# EAGLE board E-Book_Reader_Schematic (EAGLE 9.7.0)
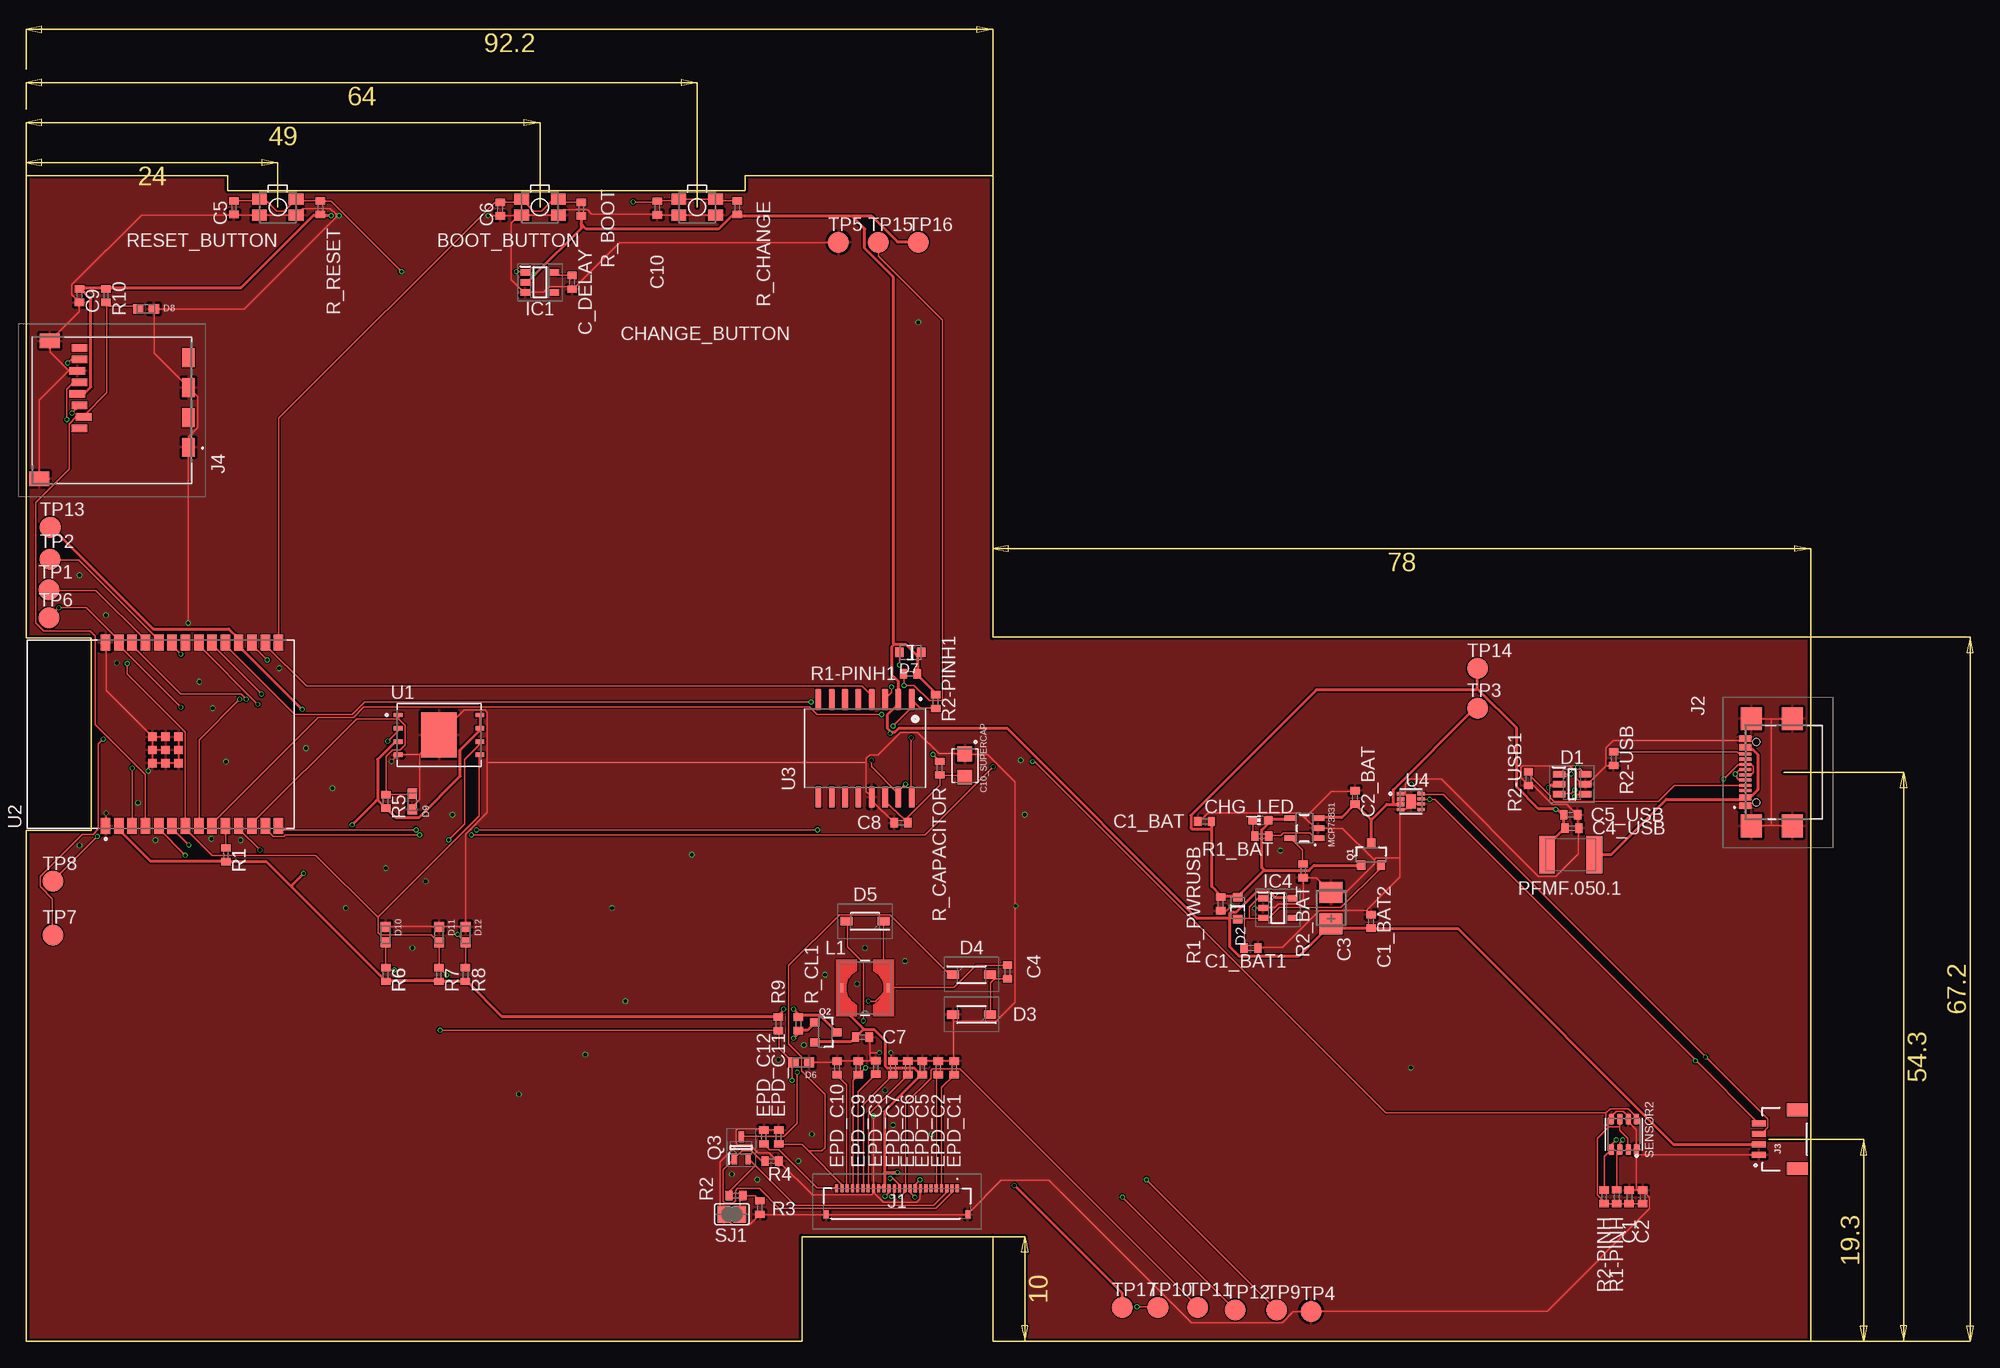
[diagram p1: board, top side]
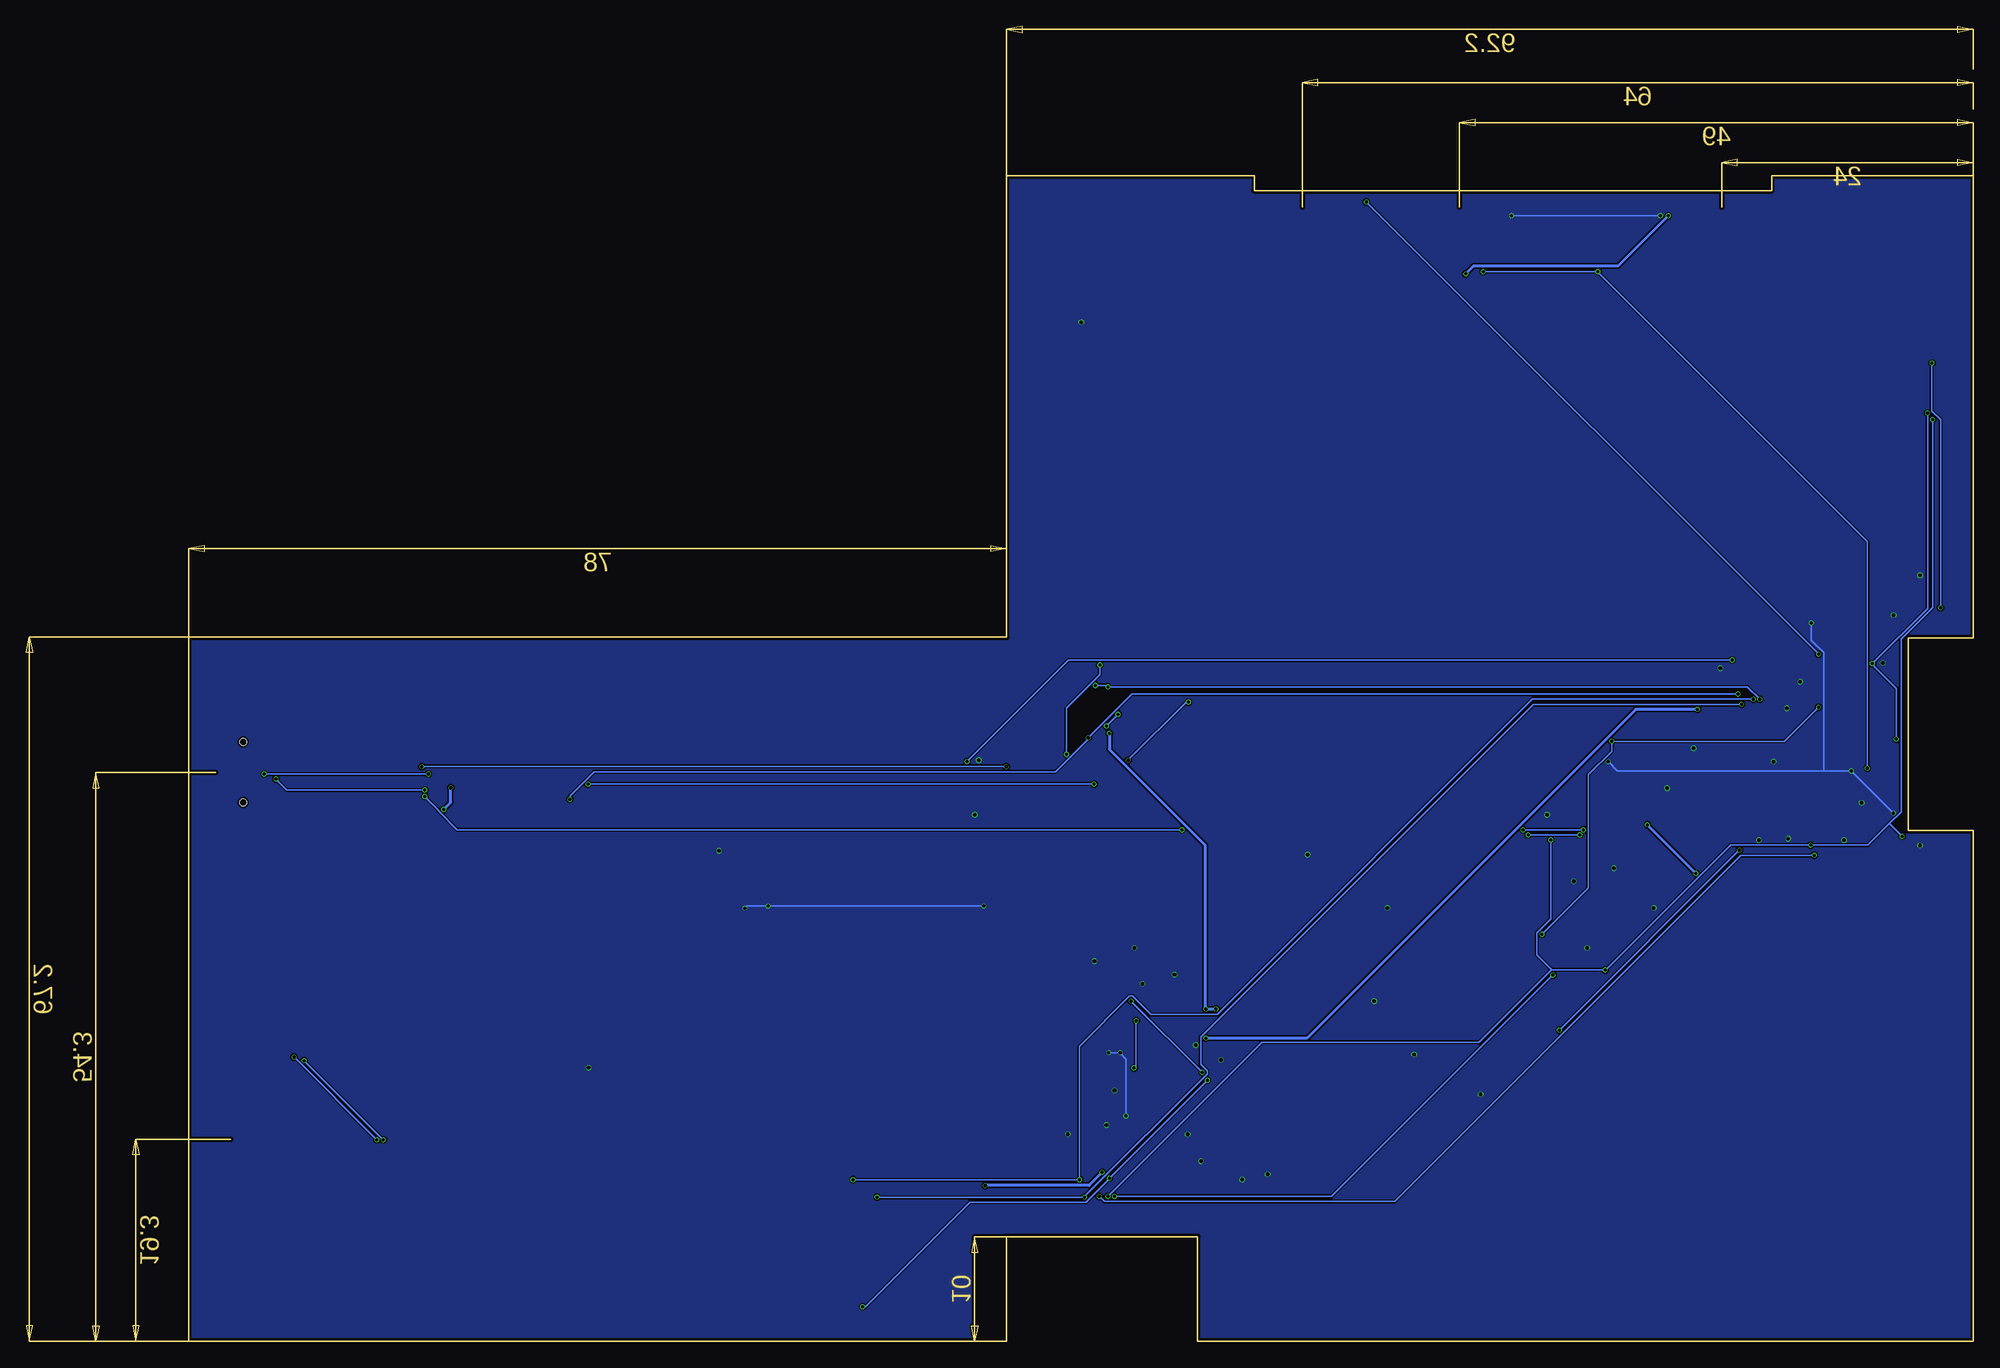
[diagram p2: board, bottom side, seen from below]

Size 170.2 x 111.2 mm. Coordinates in mm from the lower left corner, seen from the top.
Outline: 0,48.75 0,0 74,0 74,10 92.2,10 92.2,0 165.3,0 166.21,0 167.64,0 170.2,0 170.2,67.2 92.2,67.2 92.2,111.2 68.58,111.2 68.58,109.79 19.24,109.79 19.24,111.2 0,111.2 0,108.2 0,95.9 0,67.1 6.22,67.1 6.22,48.75 0,48.75
Copper layers (1*16): Top 0.035mm / dielectric 1.6mm / Bottom 0.035mm
Design rules "jlcpcb-2layers.dru": minimum track width 0.15mm, minimum drill 0.3mm, track to track 5mil, track to pad 5mil, pad to pad 5mil, via to via 5mil, smd to smd 5mil, copper to edge 0.2mm, drill to drill 6mil, minimum pad ring 10mil, minimum via ring 3mil, stop-mask expansion 4mil, vias tented up to drill 0mil, thermal gap 10mil
Net classes: 1 ALIMENTATION: width 0.3 mm

## Footprints (pad centres in the part's own frame; a part is rotated, then mirrored left to right if it is on the bottom)
MYBUTTON = smd 1.4 x 1.05: 1 1.75,0.75; 2 -1.75,0.75; 3 -1.75,-0.75; 4 1.75,-0.75
EAGLE-LTSPICE_C0402 = smd 0.7 x 0.9: 1 -0.65,0; 2 0.65,0
RCL_CT3528 = smd 2 x 2.2: + -1.5,0; - 1.5,0
ESP32_WROVER_EAGLE-LTSPICE_C0402 = smd 0.7 x 0.9: 1 -0.65,0; 2 0.65,0
CAPCP3225X100N = smd 1.4 x 1.4: 1 -1.1,0; 2 1.1,0
ADAFRUIT_CHIP-LED0603 = smd 0.8 x 0.8: A 0,-0.75; C 0,0.75
SOT95P280X145-6N = smd 1.2 x 0.6: 1 -1.25,0.95; 2 -1.25,0; 3 -1.25,-0.95; 4 1.25,-0.95; 5 1.25,0; 6 1.25,0.95
ESP32_WROVER_AVX---SD0805S020S1R0_AVX_SD0805S020S1R0_0 = smd 0.8 x 0.9: 1 -1.05,0; 2 1.05,0
SOD3716X135N = smd 1.15 x 0.8: 1 -1.75,0; 2 1.75,0
DIOC1608X36N = smd 0.97 x 0.94: 1 -0.75,0; 2 0.75,0
SOT95P280X125-5N = smd 0.9 x 0.6: 1 -1.4,0.95; 2 -1.4,0; 3 -1.4,-0.95; 4 1.4,-0.95; 5 1.4,0.95
SOT95P280X120-5N = smd 0.9 x 0.6: 1 -1.4,0.95; 2 -1.4,0; 3 -1.4,-0.95; 4 1.4,-0.95; 5 1.4,0.95
FH34SRJ24S05SH99 = smd 0.3 x 0.8: 1 5.75,1.45; 2 5.25,1.45; 3 4.75,1.45; 4 4.25,1.45; 5 3.75,1.45; 6 3.25,1.45; 7 2.75,1.45; 8 2.25,1.45; 9 1.75,1.45; 10 1.25,1.45; 11 0.75,1.45; 12 0.25,1.45; 13 -0.25,1.45; 14 -0.75,1.45; 15 -1.25,1.45; 16 -1.75,1.45; 17 -2.25,1.45; 18 -2.75,1.45; 19 -3.25,1.45; 20 -3.75,1.45; 21 -4.25,1.45; 22 -4.75,1.45; 23 -5.25,1.45; 24 -5.75,1.45 | smd 0.4 x 0.8: MP1 6.75,-1.05; MP2 -6.75,-1.05
SAMACSYS_PARTS_USB4110GFA = smd 0.3 x 1.15: A1 -3.35,3.678; A4 -2.55,3.678; A5 -1.25,3.678; A6 -0.25,3.678; A7 0.25,3.678; A8 1.25,3.678; A9 2.55,3.678; A12 3.35,3.678; B1 3.05,3.678; B4 2.25,3.678; B5 1.75,3.678; B6 0.75,3.678; B7 -0.75,3.678; B8 -1.75,3.678; B9 -2.25,3.678; B12 -3.05,3.678 | smd 2.18 x 2: MP1 -5.11,-0.827; MP2 5.11,-0.827; MP3 -5.11,3.103; MP4 5.11,3.103 | hole 0.65: -2.89,2.603; 2.89,2.603
JST04_1MM_RA = smd 0.6 x 1.35: 1 -1.5,0; 2 -0.5,0; 3 0.5,0; 4 1.5,0 | smd 1.2 x 2: NC1 2.8,-3.675; NC2 -2.8,-3.675
112ATAARR03ATTEND = smd 1.8 x 1.2: G1 10.6,10.4; G2 4.9,10.4; S1 7.75,10.4; S2 2.05,10.4 | smd 1.4 x 1.9: G3 13.6,-3.85; G4 0.45,-2.85 | smd 0.7 x 1.5: P1 8.8,0; P2 7.7,0.4; P3 6.6,0; P4 5.5,-0.2; P5 4.4,0; P6 3.3,-0.2; P7 2.2,0; P8 1.1,0
IND_4828-WE-TPC_WRE = smd 0.406 x 0.813: 1 -2.286,0; 2 2.286,0
ESP32_WROVER_SPARKFUN-IC-POWER_SOT23-5 = smd 0.55 x 1.2: 1 -0.95,-1.3; 2 0,-1.3; 3 0.95,-1.3; 4 0.95,1.3; 5 -0.95,1.3
ESP32C6_VARISTOR_CT/CN1812 = smd 1.5 x 3.6: 1 -2.25,0; 2 2.25,0
ESP32_WROVER_SPARKFUN-DISCRETESEMI_SOT23-3 = smd 0.8 x 0.9: 1 -0.95,-1; 2 0.95,-1; 3 0,1.1
SOT65P210X110-3N = smd 1.05 x 0.5: 1 -1.05,0.65; 2 -1.05,-0.65; 3 1.05,0
ESP32_WROVER_EAGLE-LTSPICE_R0402 = smd 0.7 x 0.9: 1 -0.65,0; 2 0.65,0
ESP32_WROVER_BME680_PSON80P300X300X100-8N = smd 1.016 x 0.5: 1 1.458,1.2; 2 1.458,0.4; 3 1.458,-0.4; 4 1.458,-1.2; 5 -1.458,-1.22; 6 -1.458,-0.4; 7 -1.458,0.4; 8 -1.458,1.2
SJ = smd 1.168 x 1.6: 1 -0.762,0; 2 0.762,0
TP20R = smd 2 x 2: TP 0,0
SON127P600X800X80-9N = smd 0.94 x 0.44: 1 -3.895,1.905; 2 -3.895,0.635; 3 -3.895,-0.635; 4 -3.895,-1.905; 5 3.895,-1.905; 6 3.895,-0.635; 7 3.895,0.635; 8 3.895,1.905 | smd 3.4 x 4.3: 9 0,0
XCVR_ESP32-C6-WROOM-1-N8 = smd 1.5 x 0.9: 1 -8.75,5.26; 2 -8.75,3.99; 3 -8.75,2.72; 4 -8.75,1.45; 5 -8.75,0.18; 6 -8.75,-1.09; 7 -8.75,-2.36; 8 -8.75,-3.63; 9 -8.75,-4.9; 10 -8.75,-6.17; 11 -8.75,-7.44; 12 -8.75,-8.71; 13 -8.75,-9.98; 14 -8.75,-11.25; 15 8.75,-11.25; 16 8.75,-9.98; 17 8.75,-8.71; 18 8.75,-7.44; 19 8.75,-6.17; 20 8.75,-4.9; 21 8.75,-3.63; 22 8.75,-2.36; 23 8.75,-1.09; 24 8.75,0.18; 25 8.75,1.45; 26 8.75,2.72; 27 8.75,3.99; 28 8.75,5.26 | smd 0.8 x 0.8: 29_1 -2.755,0.79; 29_2 -1.505,0.79; 29_3 -0.255,0.79; 29_4 -2.755,-0.46; 29_5 -1.505,-0.46; 29_6 -0.255,-0.46; 29_7 -2.755,-1.71; 29_8 -1.505,-1.71; 29_9 -0.255,-1.71
SOIC127P1032X265-16N = smd 2.05 x 0.59: 1 -4.655,4.445; 2 -4.655,3.175; 3 -4.655,1.905; 4 -4.655,0.635; 5 -4.655,-0.635; 6 -4.655,-1.905; 7 -4.655,-3.175; 8 -4.655,-4.445; 9 4.655,-4.445; 10 4.655,-3.175; 11 4.655,-1.905; 12 4.655,-0.635; 13 4.655,0.635; 14 4.655,1.905; 15 4.655,3.175; 16 4.655,4.445
SON50P200X200X80-9N = smd 0.76 x 0.27: 1 -0.985,0.75; 4 -0.985,-0.75; 5 0.985,-0.75; 6 0.985,-0.25; 7 0.985,0.25; 8 0.985,0.75 | smd 0.813 x 0.406: 2 -0.985,0.25; 3 -0.985,-0.25 | smd 0.9 x 1.3: 9 0,0

## Placement (x,y rotation side)
BOOT_BUTTON  BUTTON_CUSYOMV1  [MYBUTTON]  49,108.2 180 top
C1  100nF  [EAGLE-LTSPICE_C0402]  152.91,13.79 90 top
C1_BAT  4.7uF  [EAGLE-LTSPICE_C0402]  112.39,49.61 180 top
C1_BAT1  4.7uF  [EAGLE-LTSPICE_C0402]  116.84,37.54 0 top
C1_BAT2  4.7uF  [EAGLE-LTSPICE_C0402]  128.27,40.08 90 top
C2  100nF  [EAGLE-LTSPICE_C0402]  154.18,13.79 90 top
C2_BAT  4.7uF  [EAGLE-LTSPICE_C0402]  126.75,51.89 90 top
C3  100uF TANT  [RCL_CT3528]  124.46,41.35 90 top
C4  4.7uF/25V  [EAGLE-LTSPICE_C0402]  93.6,35.25 90 top
C4_USB  100nF  [ESP32_WROVER_EAGLE-LTSPICE_C0402]  147.45,48.97 0 top
C5  1uF  [EAGLE-LTSPICE_C0402]  19.81,108.15 270 top
C5_USB  4.7uF  [ESP32_WROVER_EAGLE-LTSPICE_C0402]  147.32,50.24 0 top
C6  100nF  [EAGLE-LTSPICE_C0402]  45.21,108.03 270 top
C7  10uF  [EAGLE-LTSPICE_C0402]  79.76,29.03 0 top
C8  100nF  [EAGLE-LTSPICE_C0402]  83.44,49.48 180 top
C9  100nF  [ESP32_WROVER_EAGLE-LTSPICE_C0402]  5.08,99.77 270 top
C10  100nF  [EAGLE-LTSPICE_C0402]  60.2,108.13 270 top
C10_SUPERCAP  CPH3225A  [CAPCP3225X100N]  89.53,54.94 270 top
C_DELAY  100nF  [EAGLE-LTSPICE_C0402]  52.07,101.04 270 top
CHANGE_BUTTON  BUTTON_CUSYOMV1  [MYBUTTON]  64,108.2 180 top
CHG_LED  [ADAFRUIT_CHIP-LED0603]  117.73,49.73 90 top
D1  USBLC6-2SC6Y  [SOT95P280X145-6N]  147.45,53.16 0 top
D2  SD0805S020S1R0  [ESP32_WROVER_AVX---SD0805S020S1R0_AVX_SD0805S020S1R0_0]  115.57,41.35 270 top
D3  MBR05301  [SOD3716X135N]  90.17,31.19 180 top
D4  MBR05301  [SOD3716X135N]  90.17,35 0 top
D5  MBR05301  [SOD3716X135N]  80.01,40.08 180 top
D6  PGB1010603MR  [DIOC1608X36N]  73.91,26.62 180 top
D7  SD0805S020S1R0  [ESP32_WROVER_AVX---SD0805S020S1R0_AVX_SD0805S020S1R0_0]  84.33,65.73 180 top
D8  PGB1010603MR  [DIOC1608X36N]  11.43,98.5 180 top
D9  PGB1010603MR  [DIOC1608X36N]  36.83,51.51 90 top
D10  PGB1010603MR  [DIOC1608X36N]  34.29,38.81 270 top
D11  PGB1010603MR  [DIOC1608X36N]  39.37,38.81 270 top
D12  PGB1010603MR  [DIOC1608X36N]  41.91,38.81 270 top
EPD_C1  1uF/50V  [EAGLE-LTSPICE_C0402]  88.52,26.11 90 top
EPD_C2  1uF/50V  [EAGLE-LTSPICE_C0402]  87,26.11 90 top
EPD_C5  0.1uF/50V  [EAGLE-LTSPICE_C0402]  85.47,26.11 90 top
EPD_C6  1uF/50V  [EAGLE-LTSPICE_C0402]  84.07,26.11 90 top
EPD_C7  1uF/50V  [EAGLE-LTSPICE_C0402]  82.68,26.11 90 top
EPD_C8  1uF/50V  [EAGLE-LTSPICE_C0402]  81.03,26.14 90 top
EPD_C9  1uF/50V  [EAGLE-LTSPICE_C0402]  79.38,26.11 90 top
EPD_C10  1uF/50V  [EAGLE-LTSPICE_C0402]  77.34,26.11 90 top
EPD_C11  1uF/50V  [EAGLE-LTSPICE_C0402]  71.77,19.51 90 top
EPD_C12  1uF/50V  [EAGLE-LTSPICE_C0402]  70.36,19.51 90 top
IC1  BD5229G-TR  [SOT95P280X125-5N]  49,101.04 0 top
IC4  XC6220A331MR-G  [SOT95P280X120-5N]  119.38,41.35 0 top
J1  FH34SRJ-24S-0.5SH_99_  [FH34SRJ24S05SH99]  83.06,13.16 0 top
J2  SAMACSYS_PARTS_USB4110-GF-A  [SAMACSYS_PARTS_USB4110GFA]  167.64,54.3 90 top
J3  QWIIC_RIGHT_ANGLE  [JST04_1MM_RA]  165.25,19.3 90 top
J4  112A-TAAR-R03_ATTEND  [112ATAARR03ATTEND]  5.08,95.9 270 top
L1  68uH  [IND_4828-WE-TPC_WRE]  80.01,33.73 180 top
MCP73831  ESP32_WROVER_SPARKFUN-IC-POWER_MCP73831  [ESP32_WROVER_SPARKFUN-IC-POWER_SOT23-5]  121.92,48.97 90 top
PFMF.050.1  ESP32C6_VARISTORCN1812  [ESP32C6_VARISTOR_CT/CN1812]  147.32,46.43 0 top
Q1  20V/4.2A/52mΩ/1.4W  [ESP32_WROVER_SPARKFUN-DISCRETESEMI_SOT23-3]  128.27,46.43 0 top
Q2  20V/4.2A/52mΩ/1.4W  [ESP32_WROVER_SPARKFUN-DISCRETESEMI_SOT23-3]  76.22,29.49 270 top
Q3  SI1308EDL-T1-GE3  [SOT65P210X110-3N]  68.2,18.49 90 top
R1  10K  [ESP32_WROVER_EAGLE-LTSPICE_R0402]  19.05,46.43 270 top
R1-PINH  10K  [ESP32_WROVER_EAGLE-LTSPICE_R0402]  151.71,13.81 270 top
R1-PINH1  10K  [ESP32_WROVER_EAGLE-LTSPICE_R0402]  84.33,63.7 0 top
R1_BAT  200  [ESP32_WROVER_EAGLE-LTSPICE_R0402]  117.86,48.21 0 top
R1_PWRUSB  100K  [ESP32_WROVER_EAGLE-LTSPICE_R0402]  113.92,41.73 90 top
R2  2.2  [ESP32_WROVER_EAGLE-LTSPICE_R0402]  69.98,12.78 90 top
R2-PINH  10K  [ESP32_WROVER_EAGLE-LTSPICE_R0402]  150.52,13.79 270 top
R2-PINH1  10K  [ESP32_WROVER_EAGLE-LTSPICE_R0402]  86.74,61.04 90 top
R2-USB  5K1  [ESP32_WROVER_EAGLE-LTSPICE_R0402]  151.41,55.6 270 top
R2-USB1  5k1  [ESP32_WROVER_EAGLE-LTSPICE_R0402]  143.28,53.69 90 top
R2_BAT  2K  [ESP32_WROVER_EAGLE-LTSPICE_R0402]  121.79,44.91 90 top
R3  0.47  [ESP32_WROVER_EAGLE-LTSPICE_R0402]  67.69,13.92 180 top
R4  10K  [ESP32_WROVER_EAGLE-LTSPICE_R0402]  71.12,17.22 180 top
R5  10K  [ESP32_WROVER_EAGLE-LTSPICE_R0402]  34.29,51.51 270 top
R6  10K  [ESP32_WROVER_EAGLE-LTSPICE_R0402]  34.29,35 270 top
R7  10K  [ESP32_WROVER_EAGLE-LTSPICE_R0402]  39.37,35 270 top
R8  10K  [ESP32_WROVER_EAGLE-LTSPICE_R0402]  41.91,35 270 top
R9  10K  [ESP32_WROVER_EAGLE-LTSPICE_R0402]  71.75,30.3 90 top
R10  10K  [ESP32_WROVER_EAGLE-LTSPICE_R0402]  7.62,99.77 90 top
R_BOOT  10K  [ESP32_WROVER_EAGLE-LTSPICE_R0402]  52.96,108.03 270 top
R_CAPACITOR  15  [ESP32_WROVER_EAGLE-LTSPICE_R0402]  87.12,54.69 90 top
R_CHANGE  10K  [ESP32_WROVER_EAGLE-LTSPICE_R0402]  67.82,108.15 270 top
R_CL1  10K  [ESP32_WROVER_EAGLE-LTSPICE_R0402]  73.66,30.3 90 top
R_RESET  10K  [ESP32_WROVER_EAGLE-LTSPICE_R0402]  28.07,108.15 270 top
RESET_BUTTON  BUTTON_CUSYOMV1  [MYBUTTON]  24,108.2 180 top
SENSOR2  BME688  [ESP32_WROVER_BME680_PSON80P300X300X100-8N]  152.4,19.76 270 top
SJ1  [SJ]  67.31,12.14 0 top
TP1  TPTP20R  [TP20R]  2.17,71.7 0 top
TP2  TP  [TP20R]  2.29,74.62 0 top
TP3  TP  [TP20R]  138.43,60.4 0 top
TP4  TP  [TP20R]  122.56,2.87 0 top
TP5  TP  [TP20R]  77.47,104.85 0 top
TP6  TP  [TP20R]  2.16,69.04 0 top
TP7  TP  [TP20R]  2.54,38.77 0 top
TP8  TP  [TP20R]  2.54,43.89 0 top
TP9  TP  [TP20R]  119.25,3 0 top
TP10  TP  [TP20R]  107.95,3.25 0 top
TP11  TP  [TP20R]  111.76,3.25 0 top
TP12  TP  [TP20R]  115.34,3.02 0 top
TP13  TP  [TP20R]  2.29,77.67 0 top
TP14  TP  [TP20R]  138.43,64.21 0 top
TP15  TP  [TP20R]  81.28,104.85 0 top
TP16  TP  [TP20R]  85.09,104.85 0 top
TP17  TP  [TP20R]  104.55,3.25 0 top
U1  W25Q512JVEIQ  [SON127P600X800X80-9N]  39.37,57.86 0 top
U2  ESP32-C6-WROOM-1-N8  [XCVR_ESP32-C6-WROOM-1-N8]  12.83,57.93 90 top
U3  DS3231SN#  [SOIC127P1032X265-16N]  80.01,56.59 270 top
U4  MAX17048G+T10  [SON50P200X200X80-9N]  132.08,51.51 0 top

## Tracks (layer width: path | path; a pad name or v marks a point on that pad's centre or on a via)
3V3  (via drill 0.3)
  Top 0.3: U1.8 43.28,59.75 43.28,58.5 U1.7 43.21,58.36 43.21,58.22 41.41,56.42 41.41,53.93 37.46,49.98 35.25,49.98 34.42,50.81 R5.2 34.28,50.88 33.52,51.65 | 33.52,51.65 33.52,55.52 35.18,57.19 35.46,57.19 U1.3 | U2.2 8.86,49.15 8.86,48.81 11.84,45.83 19.04,45.83 R1.2 19.18,45.76 22.92,45.76 25.24,43.44 | Q2.3 77.28,29.55 75.97,30.87 75.97,30.94 75.76,31.15 73.82,31.15 73.68,31.01 R_CL1.2 73.68,31.22 v73.2,31.7 | v72.23,31.7 72.23,31.56 71.81,31.15 R9.2 71.74,31.01 45.36,31.01 42.03,34.33 R8.2 41.9,34.4 39.47,34.4 R7.2 39.33,34.4 34.35,34.4 R6.2 34.21,34.47 25.24,43.44 | v31.09,49.29 33.38,51.58 33.52,51.65 | v26.45,44.65 25.35,43.54 25.24,43.44 | 114.82,40.43 114.82,37.66 115.72,36.76 121.39,36.76 124.44,39.8 C3.+ 124.58,39.73 124.86,39.46 128.25,39.46 C1_BAT2.1 128.39,39.39 136.56,39.39 157.13,18.82 165.23,18.82 J3.2 | 114.82,40.43 114.82,40.84 114.95,40.98 115.44,40.98 117.38,42.92 118.56,42.92 119.11,42.37 120.77,42.37 IC4.5 | 5.12,100.47 6.16,100.47 7.62,100.47 R10.2 7.76,100.53 20.5,100.53 27.42,107.46 28.05,107.46 R_RESET.2 28.18,107.39 v29.09,107.39 | 5.12,100.47 C9.1 | J4.P4 4.92,90.43 5.54,90.43 6.16,91.05 6.16,99.43 5.12,100.47 | 85.04,65.43 85.04,63.76 R1-PINH1.2 85.04,63.56 86.7,61.89 86.7,61.69 R2-PINH1.2 | 85.04,65.43 85.32,65.7 D7.1 | 82.75,66.46 82.55,66.26 82.55,63.62 83.17,63 83.17,61.27 U3.2 83.1,61.13 83.1,60.72 82.13,59.75 82.13,58.5 82.48,58.16 | 82.75,66.46 83.93,66.46 84.9,65.5 85.04,65.43 | 48.51,101.75 52.91,106.15 52.91,106.63 | 48.51,101.75 47.85,101.09 47.64,101.09 IC1.2 | 52.91,106.63 52.91,107.32 R_BOOT.2 | 78.74,107.39 67.93,107.39 R_CHANGE.2 67.8,107.46 67.38,107.46 66.55,106.63 66.04,106.12 54.61,106.12 53.42,106.12 52.91,106.63
  Top 0.3: 78.74,107.39 79.98,107.39 80.61,107.39 83.1,104.9 85.04,104.9 TP16.TP | 82.75,66.46 82.68,66.6 82.68,101.57 79.98,104.28 79.98,106.09 80.01,106.12 78.74,107.39 | v48.41,101.85 48.51,101.75 | 82.48,58.16 82.89,58.16 83.24,58.5 93.56,58.5 111.63,40.43 114.68,40.43 114.82,40.43 | v82.41,58.02 82.48,58.16
  Bottom 0.3: v72.23,31.7 v73.2,31.7 73.27,31.84 73.27,47.35 82.41,56.49 v82.41,58.02 | v26.45,44.65 v31.09,49.29 | v29.09,107.39 33.86,102.61 47.64,102.61 v48.41,101.85
32KHZ  (via drill 0.3)
  Top 0.15: 84.83,60.86 84.48,61.2 U3.1 | 84.83,60.86 85.25,60.44 86.7,60.44 R2-PINH1.1 | v81.58,59.82 75.41,59.82 74.72,60.51 32.2,60.51 31.23,59.54 27.84,59.54 17.73,49.43 17.73,49.22 U2.9 | 84.83,60.86 v82.68,58.71
  Bottom 0.15: v82.68,58.71 v81.58,59.82
DN  (via drill 0.3)
  Top 0.15: 163.15,54.14 163.15,54.28 163.36,54.48 163.91,54.48 J2.A7 | 163.15,54.14 163.15,53.79 163.36,53.58 163.91,53.58 J2.B7 | v147.36,54.14 146.26,54.14 D1.1 | v163.01,54.14 163.08,54.14 163.15,54.14
  Bottom 0.15: v163.01,54.14 v147.36,54.14
DP  (via drill 0.3)
  Top 0.15: J2.A6 163.98,54.07 164.54,54.07 164.75,54.28 164.75,54.83 164.54,55.04 163.98,55.04 J2.B6 163.91,55.04 163.29,55.04 v161.91,53.65 | v147.71,52.61 147.36,52.27 146.26,52.27 D1.3
  Bottom 0.15: v147.71,52.61 160.87,52.61 v161.91,53.65
EPD_3V3  (via drill 0.3)
  Top 0.3: J1.16 81.37,14.67 81.78,14.67 J1.15 81.85,14.8 81.85,16.12 | 79.84,29.76 80.88,29.76 81.92,28.72 81.92,26.3 82.13,26.09 84.69,26.09 85.32,25.47 85.45,25.47 EPD_C5.1 85.25,25.33 81.85,21.94 81.85,16.12 | 79.84,29.76 79.15,29.07 C7.1 79.01,28.93 78.67,28.59 75.28,28.59 Q2.2 | v94.25,14.87 104.5,4.62 104.5,3.31 TP17.TP | v83.1,16.12 81.99,16.12 81.85,16.12 | L1.2 77.77,33.71 77.77,31.91 79.78,29.9 79.84,29.76
  Bottom 0.3: v94.25,14.87 84.35,14.87 v83.1,16.12
EPD_3V3_C  (via drill 0.3)
  Top 0.3: Q2.1 75.21,30.39 74.51,29.69 73.68,29.69 R_CL1.1 73.54,29.55 73.54,29.28 v73.2,28.93 | TP13.TP 2.35,77.61 2.49,77.61 12.12,67.99 19.32,67.99 20.22,67.09 20.22,66.74 U2.18 20.29,66.53 20.29,66.33 v26.32,60.3
  Bottom 0.3: v73.2,28.93 63.57,28.93 32.2,60.3 v26.32,60.3
EPD_BUSY  (via drill 0.3)
  Top 0.15: v85.25,15.43 84.83,15.01 84.83,14.67 J1.9 | v106.85,15.43 119.25,3.03 TP9.TP | v20.98,61.27 20.5,61.76 14.75,61.76 10.11,66.4 U2.26
  Bottom 0.15: v106.85,15.43 v85.25,15.43 85.25,15.5 85.25,28.17 80.47,32.95 80.19,32.95 78.46,31.22 72.09,31.22 42.03,61.27 v20.98,61.27
EPD_CS  (via drill 0.3)
  Top 0.15: v82.41,15.57 82.68,15.57 83.31,14.94 83.31,14.67 J1.12 | v73.06,24.92 73.06,26.51 73.13,26.58 D6.2 73.13,26.65 71.81,27.96 71.81,29.62 R9.1 71.74,29.69 v39.47,29.69 | v22.3,46.87 20.29,48.88 20.29,49.15 U2.11 | v105.95,3.31 107.89,3.31 TP10.TP
  Bottom 0.15: v73.06,24.92 v82.41,15.57 82.41,15.5 84.62,13.28 95.7,13.28 105.67,3.31 v105.95,3.31 | v39.47,29.69 v22.3,46.87
EPD_DC  (via drill 0.3)
  Top 0.15: TP11.TP 111.77,3.31 89.06,26.02 86.42,26.02 86.28,25.88 86.28,25.12 83.86,22.7 83.86,14.67 J1.11 83.79,14.6 83.79,14.25 v83.38,13.84 | v15.17,46.38 12.67,48.88 12.67,49.15 U2.5
  Bottom 0.15: v15.17,46.38 22.16,46.38 55.19,13.35 82.89,13.35 v83.38,13.84
EPD_RST  (via drill 0.3)
  Top 0.15: v84.76,13.77 84.35,14.18 84.35,14.6 J1.10 | v104.57,13.77 115.3,3.03 TP12.TP | v22.09,60.79 16.48,66.4 16.48,66.67 U2.21
  Bottom 0.15: v104.57,13.77 v84.76,13.77 84.76,13.84 73.06,25.54 73.06,25.81 73.68,26.44 73.68,29.07 41.97,60.79 v22.09,60.79
FLASH_CS
  Top 0.15: D9.2 36.77,52.2 34.35,52.2 R5.1 34.35,52.27 34.35,55.8 34.97,56.42 35.66,56.42 36.15,56.91 36.15,58.78 35.52,59.4 | 35.52,59.4 35.52,59.75 U1.1 | U2.12 21.61,49.22 21.61,49.5 31.51,59.4 35.46,59.4 35.52,59.4
GDR
  Top 0.15: J1.2 88.29,14.6 88.29,14.25 86.77,12.73 71.81,12.73 69.94,14.6 67.86,14.6 67.66,14.39 67.66,13.42 67.45,13.21 66.62,13.21 66.48,13.35 66.48,16.4 67.52,17.44 Q3.1 67.59,17.51 68.28,18.2 69.18,18.2 70.15,17.23 70.43,17.23 R4.2
GND  (via drill 0.3, 0.35)
  Top 0.15: CHANGE_BUTTON.2 65.72,107.46 62.33,107.46 CHANGE_BUTTON.1 62.19,107.46 60.25,107.46 C10.2 60.18,107.53 53.95,107.53 53.53,107.95 51.24,107.95 BOOT_BUTTON.2 50.69,107.46 47.3,107.46 BOOT_BUTTON.1 47.23,107.39 46.99,107.39 | 46.99,107.39 46.26,107.39 45.22,107.39 C6.2 45.15,107.39 v44.04,107.39 | TP5.TP 77.42,104.83 56.58,104.83 52.15,100.4 C_DELAY.2 52.01,100.4 51.8,100.61 49.86,100.61 49.38,100.12 47.64,100.12 IC1.3 47.58,100.12 47.44,100.12 46.26,101.3 46.26,106.66 46.99,107.39 | 4.02,92.64 4.85,92.64 J4.P6 | 4.02,92.64 2.29,94.37 2.29,95.41 J4.G4 2.29,95.48 5.05,98.25 5.05,99.08 C9.2 5.05,99.15 4.36,99.84 4.36,100.81 11.01,107.46 19.8,107.46 C5.2 19.88,107.46 22.23,107.46 RESET_BUTTON.1 22.3,107.46 25.69,107.46 RESET_BUTTON.2 26.38,108.08 29.02,108.08 29.57,107.53 29.57,107.39 | J4.G3 1.25,82.32 1.25,89.8 4.02,92.57 4.02,92.64 | 29.57,107.39 29.57,107.25 20.77,98.46 12.26,98.46 D8.1 12.19,98.46 12.19,94.3 15.44,91.05 J4.G2 15.51,90.98 16.34,90.15 16.34,87.17 15.51,86.34 15.51,85.3 J4.G1 15.44,85.23 v15.44,68.54 | v29.85,107.39 29.64,107.39 29.57,107.39 | 121.98,49.95 122.92,49.01 123.2,49.01 MCP73831.2 123.27,48.94 125.55,48.94 128.53,45.97 128.6,45.97 | 121.98,49.95 121.53,50.4 112.74,50.4 111.98,49.64 111.77,49.64 C1_BAT.2 | C2_BAT.2 126.73,52.48 124.51,52.48 122.02,49.98 121.98,49.95 | v114.95,41.53 114.54,41.12 113.99,41.12 R1_PWRUSB.1 | v117.17,41.33 117.93,41.33 IC4.2 118,41.4 119.11,41.4 119.46,41.74 121.33,41.74 121.81,42.23 121.81,44.17 R2_BAT.1 121.81,44.23 123.06,44.23 124.44,42.85 C3.- 124.51,42.85 125.9,42.85 128.6,45.55 128.6,45.97
  Top 0.15: U4.9 132.06,51.51 132.06,51.3 131.57,50.81 131.16,50.81 U4.4 131.02,50.75 131.02,46.11 | 131.57,52.2 131.16,52.2 U4.1 | 131.57,52.2 132.06,51.71 132.06,51.58 U4.9 | U4.6 133.03,51.3 132.13,51.3 U4.9 | 127.91,41.12 123.33,41.12 119.8,37.59 117.52,37.59 C1_BAT1.2 | 127.91,41.12 128.25,40.77 C1_BAT2.2 | 131.02,46.11 131.02,44.31 127.91,41.19 127.91,41.12 | 128.6,45.97 128.74,46.11 130.95,46.11 131.02,46.11 | 150.69,54.9 151.38,54.9 R2-USB.2 | 150.69,54.9 148.96,53.17 148.75,53.17 D1.5 148.68,53.17 148.4,53.17 147.85,53.72 147.85,54.28 147.23,54.9 142.72,54.9 142.59,54.76 142.59,53.79 143.28,53.1 R2-USB1.1 143.35,53.03 143.76,53.03 145.56,51.23 146.95,51.23 147.92,50.26 C5_USB.2 147.99,50.19 147.99,49.08 148.06,49.01 C4_USB.2 148.06,48.94 148.06,46.52 145.91,44.37 144.25,44.37 134.97,53.65 131.99,53.65 131.57,53.24 131.57,52.27 131.57,52.2 | J2.B12 163.98,51.23 163.98,50.95 J2.A1 163.98,50.88 163.98,49.71 164.47,49.22 J2.MP3 164.54,49.22 166.48,49.22 | 166.48,49.22 168.42,49.22 J2.MP1 | 166.48,59.4 164.61,59.4 J2.MP4 164.47,59.4 163.98,58.92 163.98,57.67 J2.A12 163.98,57.6 163.98,57.39 J2.B1 163.91,57.32 151.38,57.32 150.69,56.63 150.69,54.97 150.69,54.9 | 166.48,59.4 168.42,59.4 J2.MP2 | 166.48,49.22 166.48,49.29 166.48,59.33 166.48,59.4 | U2.29_1 13.23,55.18 U2.29_4 14.47,55.18 U2.29_7 14.54,55.25 U2.29_8 14.54,56.49 U2.29_9 | v7.62,50.4 7.62,49.22 U2.1 | v11.63,54.42 11.63,54.69 12.05,55.11 U2.29_1 | U2.29_2 13.23,56.42 U2.29_5 | U2.29_3 13.23,57.67 U2.29_6 | U2.29_2 12.05,56.49 12.05,57.6 U2.29_3 | U2.28 7.62,66.67 7.62,62.1 11.98,57.74 U2.29_3
  Top 0.15: U2.29_1 12.05,55.25 12.05,56.35 U2.29_2 | D10.1 34.35,39.59 39.33,39.59 D11.1 39.4,39.59 41.9,39.59 D12.1 41.9,39.67 41.9,48.39 43.97,50.47 43.97,55.25 | 37.53,56.01 35.52,56.01 U1.4 35.46,55.94 v34.83,55.32 | 37.53,56.01 39.33,57.81 U1.9 39.4,57.88 41.76,60.23 43.77,60.23 43.97,60.02 43.97,55.25 | D9.1 36.84,50.81 36.84,51.02 37.53,51.71 37.53,55.94 37.53,56.01 | 153.6,14.46 154.15,14.46 C2.2 154.22,14.39 154.84,13.77 154.84,12.66 145.08,2.89 122.57,2.89 TP4.TP 122.5,2.82 120.84,2.82 119.8,1.78 111.15,1.78 97.57,15.36 93,15.36 89.82,12.17 J1.MP1 89.75,12.1 76.38,12.1 J1.MP2 76.24,12.1 70.01,12.1 R2.1 69.94,12.1 68.97,11.13 67.38,11.13 66.55,11.97 66.55,12.1 SJ1.1 66.48,12.17 66.2,12.45 66.2,17.16 67.8,18.75 67.86,18.75 | 153.6,14.46 152.97,14.46 C1.2 | SENSOR2.5 151.24,21.24 151.24,21.52 151.66,21.94 152.35,21.94 152.77,21.52 152.77,21.24 SENSOR2.7 152.84,21.17 152.84,20.97 153.6,20.2 153.6,18.34 SENSOR2.1 153.6,18.27 153.6,17.78 | 153.6,17.78 153.6,14.53 153.6,14.46 | J3.1 165.23,17.78 153.67,17.78 153.6,17.78 | 80.81,14.25 80.81,14.6 J1.17 80.81,14.67 v80.81,21.52 | 80.81,14.25 81.78,13.28 84.9,13.28 85.25,13.63 85.25,14.6 J1.8 | EPD_C11.2 71.74,20.2 70.36,20.2 EPD_C12.2 70.36,20.28 67.86,20.28 67.73,20.14 67.73,18.89 67.86,18.75 | 67.86,18.75 69.04,18.75 69.8,17.99 70.84,17.99 71.61,17.23 71.74,17.23 R4.1 71.81,17.16 75,13.97 80.61,13.97 80.81,14.18 80.81,14.25 | C8.2 82.75,49.5 80.68,51.58 80.68,51.92 U3.13 80.61,51.99 80.12,52.48 80.12,55.25 | 80.12,55.25 80.12,55.59 80.47,55.94 81.23,55.94 83.38,58.09 85.04,58.09 87.05,56.08 89.47,56.08 C10_SUPERCAP.1 89.54,56.01 91.69,56.01 94.32,53.38 94.32,41.53
  Top 0.15: 80.47,26.78 79.43,26.78 EPD_C9.2 79.36,26.78 77.35,26.78 EPD_C10.2 77.28,26.72 77.21,26.65 74.72,26.65 D6.1 | 80.47,26.78 EPD_C8.2 | 80.47,27.55 80.47,26.85 80.47,26.78 | 80.47,27.55 80.47,29 C7.2 | 88.43,30.52 88.43,26.85 EPD_C1.2 88.5,26.78 87.05,26.78 EPD_C2.2 86.98,26.78 85.52,26.78 EPD_C5.2 85.45,26.78 84.14,26.78 EPD_C6.2 84.07,26.78 82.68,26.78 EPD_C7.2 82.68,26.85 82.48,27.06 v82.48,27.55 | 88.43,30.52 88.43,31.15 D3.2 | v81.37,27.55 80.54,27.55 80.47,27.55 | 94.32,41.53 94.32,32.32 92.52,30.52 88.5,30.52 88.43,30.52 | 43.97,55.25 44.04,55.25 80.05,55.25 80.12,55.25 | v94.39,41.53 94.32,41.53
  Bottom 0.15: v29.85,107.39 v44.04,107.39 | v117.17,41.33 116.96,41.53 v114.95,41.53 114.89,41.53 v94.39,41.53 | v7.62,50.4 v11.63,54.42 11.7,54.42 14.27,54.42 | 14.27,54.42 33.93,54.42 v34.83,55.32 | v82.48,27.55 v81.37,27.55 81.37,27.48 80.81,26.92 v80.81,21.52 | v15.44,68.54 15.44,66.88 14.27,65.7 14.27,54.48 14.27,54.42
  other vias: 132.08,26.11 85.09,97.23 34.29,45.16 29.21,52.78 30.48,41.35 36.83,37.54 26.67,56.59 19.05,55.32 16.51,62.94 17.78,60.4 76.2,35 83.82,36.27 86.36,19.76 46.99,23.57 53.34,27.38 57.15,32.46 55.88,41.35 63.5,46.43 95.25,50.24 38.1,43.89 40.64,50.24 8.64,64.72 94.87,55.45 71.75,26.87 74.17,28.27 82.68,20.65 81.92,23.95 74.93,19.76 73.66,17.22 69.72,15.44 67.31,15.95 80.01,37.54 79.25,34.11 119.63,46.81 24.13,64.21 7.62,69.29 5.08,73.1 12.32,47.83 17.65,47.95 20.45,47.83 10.67,51.38 5.08,47.32
  pour Bottom: -11.4,-14.45 176.5,-14.45 180.26,-10.69 180.26,109.9 175.23,114.93 -13.94,114.93 -20.24,108.63 -20.24,-5.61
  pour Top: -8.86,-16.99 176.5,-16.99 181.53,-11.96 181.53,108.63 175.23,114.93 -12.67,114.93 -20.24,107.36 -20.24,-5.61
GPIO8
  Top 0.15: R1.1 19.04,47.14 19.04,49.15 U2.10
I2C_PW  (via drill 0.3)
  Top 0.15: C2.1 154.15,13.14 152.97,13.14 C1.1 151.73,13.14 R1-PINH.2 151.66,13.14 150.55,13.14 R2-PINH.2 150.48,13.21 150.48,13.35 149.86,13.97 149.86,19.37 150.9,20.41 150.9,20.48 | 152,20.48 152,20.14 152.77,19.37 152.77,18.34 SENSOR2.2 | 152,20.48 152,21.17 SENSOR2.6 | 150.69,21.8 151.1,22.21 152.84,22.21 153.6,21.45 153.6,21.24 SENSOR2.8 | 150.69,21.8 150.69,20.69 150.9,20.48 | 150.9,20.48 151.94,20.48 152,20.48 | v22.99,65.01 21.61,66.4 21.61,66.67 U2.17 | v95.98,55.32 96.19,55.32 129.71,21.8 150.62,21.8 150.69,21.8
  Bottom 0.15: v22.99,65.01 86.28,65.01 v95.98,55.32
INT_RTC  (via drill 0.3)
  Top 0.15: v82.55,62.45 82.55,61.89 81.92,61.27 U3.3 | R1-PINH1.1 83.72,63.7 v83.72,62.59 83.79,62.59 84.69,62.59 86.15,61.13 87.32,61.13 87.39,61.2 87.39,97.42 81.3,103.51 81.3,104.83 TP15.TP | v20.36,61.27 16.48,57.39 16.48,49.22 U2.8
  Bottom 0.15: v83.72,62.59 82.68,62.59 v82.55,62.45 82.48,62.45 21.54,62.45 v20.36,61.27
IO/BOOT
  Top 0.15: R_BOOT.1 52.91,108.71 50.97,108.71 50.76,108.92 BOOT_BUTTON.3 50.69,108.92 50.28,108.92 49.17,107.81 48.41,107.81 47.3,108.92 BOOT_BUTTON.4 47.23,108.92 47.02,108.71 45.22,108.71 C6.1 45.15,108.64 44.67,108.64 24.1,88.07 24.1,66.74 U2.15
IO/CHANGE  (via drill 0.3)
  Top 0.15: R_CHANGE.1 67.8,108.85 65.86,108.85 65.79,108.92 CHANGE_BUTTON.3 65.72,108.98 62.26,108.98 CHANGE_BUTTON.4 62.19,108.92 62.12,108.85 60.25,108.85 C10.1 60.18,108.71 v57.89,108.71 | v14.75,65.56 13.92,66.4 U2.23
  Bottom 0.15: v57.89,108.71 v14.75,65.56
MISO  (via drill 0.3)
  Top 0.15: R8.1 41.9,35.72 41.9,38 D12.2 41.9,38.07 v41.13,38.83 | v34.49,57.25 35.46,58.22 35.46,58.43 U1.2 | v3.95,93.33 4.29,93.68 5.05,93.68 J4.P7 | TP6.TP 2.22,69.1 v3.12,70 3.19,70 5.75,70 8.79,66.95 8.79,66.74 U2.27 8.86,66.67 8.86,66.4 v14.75,60.51
  Bottom 0.15: v41.13,38.83 36.7,43.27 36.7,54.07 34.49,56.29 v34.49,57.25 34.42,57.25 18,57.25 v14.75,60.51 | v3.95,93.33 3.95,88.76 3.12,87.93 v3.12,70
MOSI  (via drill 0.3)
  Top 0.15: v81.92,13.84 82.27,14.18 82.27,14.6 J1.14 | v40.1,34.96 39.4,35.65 R7.1 39.4,35.72 39.4,38 D11.2 39.33,38.07 38.64,38.76 33.79,38.76 33.59,38.97 33.59,40.5 | 33.59,40.5 43.21,50.12 43.21,55.94 U1.5 | 33.59,40.5 33.52,40.5 27.63,46.38 17.73,46.38 15.23,48.88 15.23,49.15 U2.7 15.17,49.22 15.17,58.16 9.63,63.7 v9.63,64.66 | v4.36,88.56 5.05,89.25 J4.P3 | v7.34,57.46 6.86,56.98 6.86,48.88 6.37,48.39 5.33,48.39 1.32,44.37 1.32,43.4 2.49,42.23 2.49,38.83 TP7.TP
  Bottom 0.15: v81.92,13.84 61.22,13.84 v40.1,34.96 | v4.36,88.56 4.36,69.93 v9.63,64.66 9.63,64.59 7.34,62.31 v7.34,57.46
N$1
  Top 0.15: R1_BAT.2 118.56,48.25 119.66,48.25 119.94,48.53 122.43,48.53 122.92,48.04 123.2,48.04 MCP73831.1
N$2
  Top 0.15: R2-USB1.2 143.35,54.28 143.35,54.07 145.36,52.06 145.36,51.85 145.7,51.51 155.67,51.51 157.2,53.03 163.91,53.03 J2.A5
N$3
  Top 0.15: 116.69,40.36 117.93,40.36 IC4.3 118,40.43 118.56,40.43 119.53,41.4 125.41,41.4 129.15,45.14 129.15,45.41 Q1.2 | 116.69,40.36 116.2,40.36 | 116.2,40.36 115.58,40.36 D2.2 | C1_BAT1.1 116.2,37.59 116.2,40.29 116.2,40.36 | IC4.1 117.93,42.3 117.52,42.3 116.69,41.47 116.69,40.43 116.69,40.36
N$4
  Top 0.15: R2-USB.1 151.45,56.22 163.22,56.22 163.36,56.08 163.91,56.08 J2.B5
N$5
  Top 0.15: CHG_LED.C 117.03,49.71 117.03,48.39 117.17,48.25 R1_BAT.1
N$6
  Top 0.15: 92.31,34.61 93.56,34.61 C4.1 | 92.31,34.61 91.96,34.96 D4.2 | D3.1 91.96,31.22 91.96,34.19 92.31,34.54 92.31,34.61
N$7
  Top 0.15: J1.24 77.28,14.67 75.41,14.67 71.81,18.27 70.91,18.27 70.36,18.82 EPD_C12.1
N$8
  Top 0.15: R2_BAT.2 121.74,45.62 121.74,46.87 120.63,47.98 MCP73831.5
N$9
  Top 0.15: C_DELAY.1 52.01,101.71 50.69,101.71 50.41,101.99 IC1.5
N$10
  Top 0.15: J1.22 78.25,14.67 78.25,24.5 77.35,25.4 EPD_C10.1
N$11  (via drill 0.3)
  Top 0.15: v83.31,64.53 83.31,65.7 D7.2 | v86.49,56.01 87.12,55.38 R_CAPACITOR.2
  Bottom 0.15: v83.31,64.53 83.31,63.62 86.49,60.44 v86.49,56.01
N$12
  Top 0.15: J1.20 79.36,14.67 79.36,23.81 81.02,25.47 EPD_C8.1
N$13
  Top 0.15: J1.19 79.84,14.67 79.84,22.63 82.61,25.4 EPD_C7.1
N$14
  Top 0.15: J1.18 80.33,14.67 80.33,21.66 84.07,25.4 EPD_C6.1
N$22
  Top 0.15: J1.4 87.32,14.67 87.32,24.22 88.5,25.4 EPD_C1.1
N$23
  Top 0.15: J1.5 86.84,14.67 86.84,25.26 86.98,25.4 EPD_C2.1
PREVGH  (via drill 0.3)
  Top 0.15: J1.21 78.88,14.67 78.88,24.92 79.36,25.4 EPD_C9.1 79.43,25.47 v80.05,26.09 | v79.84,30.59 79.84,36.13 78.32,37.66 78.32,40.01 D5.2
  Bottom 0.15: v79.84,30.59 79.84,26.3 v80.05,26.09
PREVGL
  Top 0.15: 74.61,18.17 73.99,18.79 73.96,18.82 71.81,18.82 EPD_C11.1 | 74.61,18.17 77.77,15.01 77.77,14.67 J1.23 | D4.1 88.36,35.03 88.09,35.03 82.41,40.7 77.56,40.7 72.71,35.86 72.71,28.38 73.96,27.13 73.96,25.88 73.96,25.81 76.2,23.57 76.2,18.49 75.88,18.17 74.61,18.17
RESE
  Top 0.15: 69.56,16.78 68.9,17.44 Q3.2 | 69.56,16.78 73.34,13 86.56,13 87.74,14.18 87.74,14.6 J1.3 | R3.2 67.1,13.97 67.1,14.32 69.53,16.74 69.56,16.78
RESE'
  Top 0.15: R2.2 69.94,13.49 69.53,13.9 68.35,13.9 R3.1 68.35,13.84 68.07,13.56 68.07,12.17 SJ1.2
RESET  (via drill 0.3)
  Top 0.15: C5.1 19.88,108.85 22.16,108.85 22.23,108.92 RESET_BUTTON.4 22.3,108.92 22.78,108.92 23.89,107.81 24.58,107.81 25.69,108.92 RESET_BUTTON.3 25.76,108.92 25.83,108.85 28.05,108.85 R_RESET.1 28.12,108.78 29.09,108.78 v35.8,102.06 | v46.74,102.06 47.58,102.06 IC1.1 | v10.11,54.69 10.11,49.22 U2.3
  Bottom 0.15: v46.74,102.06 v35.8,102.06 35.8,101.99 10.11,76.3 v10.11,54.69
RTC_RST
  Top 0.15: U2.16 22.85,66.67 22.85,66.4 26.73,62.52 79.71,62.52 80.61,61.62 80.61,61.27 U3.4
RX
  Top 0.15: U2.24 12.6,66.74 12.6,66.95 4.99,74.57 2.35,74.57 TP2.TP
SCK  (via drill 0.3)
  Top 0.15: v82.55,13.84 82.75,14.04 82.75,14.6 J1.13 | v35.11,35.44 34.56,35.44 34.35,35.65 R6.1 34.28,35.72 34.28,38 D10.2 | v40.3,47.84 41.83,49.36 41.83,55.52 43.21,56.91 43.21,57.19 U1.6 | v15.51,47.35 13.92,48.94 13.92,49.15 U2.6 | v3.88,87.93 3.88,90.84 4.5,91.46 5.05,91.46 J4.P5 | v6.79,48.18 2.56,43.96 TP8.TP
  Bottom 0.15: v82.55,13.84 67.86,28.52 47.16,28.52 40.23,35.44 | 40.23,35.44 v35.11,35.44 35.04,35.44 23.13,47.35 v15.51,47.35 15.44,47.35 10.04,47.35 8,49.39 | v40.3,47.84 40.3,40.29 41.62,38.97 41.62,36.89 40.23,35.51 40.23,35.44 | v3.88,87.93 3.88,70 6.86,67.02 6.86,50.54 8,49.39 | v6.79,48.18 7.96,49.36 8,49.39
SCL  (via drill 0.3)
  Top 0.15: R2-PINH.1 150.55,14.46 150.55,17.64 151.17,18.27 SENSOR2.4 151.24,18.34 151.24,18.82 v151.66,19.24 | 159.24,26.82 165.23,20.83 J3.4 | 159.24,26.82 134.34,51.71 v133.86,51.71 133.1,51.71 U4.7 | v159.21,26.78 159.24,26.82 | v22.44,61.76 17.73,66.46 U2.20 | v84.42,57.6 84.42,51.99 U3.16
  Bottom 0.15: v159.21,26.78 v151.66,19.24 | v22.44,61.76 80.26,61.76 v84.42,57.6 84.42,57.53 84.42,57.46 87.53,54.35 131.57,54.35 133.86,52.06 v133.86,51.71
SDA  (via drill 0.3)
  Top 0.15: R1-PINH.1 151.73,14.53 151.73,18.06 151.94,18.27 SENSOR2.3 152,18.34 152,18.96 v152.28,19.24 | 160.21,27.17 166.13,21.24 166.13,20.41 165.58,19.86 165.3,19.86 J3.3 | 160.21,27.17 135.18,52.2 133.1,52.2 U4.8 133.03,52.27 v132.13,53.17 | v160.18,27.13 160.21,27.17 | v74.86,60.99 32.27,60.99 31.09,59.82 25.62,59.82 19.04,66.4 19.04,66.67 U2.19 | v80.61,55.45 80.61,54.83 83.17,52.27 83.17,51.99 U3.15 83.1,52.41 v83.86,53.17
  Bottom 0.15: v160.18,27.13 v152.28,19.24 | v74.86,60.99 75.07,60.99 v80.61,55.45 | v83.86,53.17 v132.13,53.17
SRC  (via drill 0.3)
  Top 0.15: C4.2 93.56,35.86 90.58,35.86 88.5,33.78 82.34,33.78 L1.1 | v73.54,25.68 73.54,20.83 72.3,19.58 68.21,19.58 Q3.3 | v80.33,32.46 81.02,32.46 82.27,33.71 L1.1 | D5.1 81.78,40.01 81.78,34.4 82.34,33.85 L1.1
  Bottom 0.15: v80.33,32.46 v73.54,25.68
SS_SD
  Top 0.15: D8.2 10.66,98.53 10.43,98.77 7.93,98.77 7.69,99.01 | 7.69,99.01 7.69,90.49 5.54,88.35 5.54,88.21 J4.P2 5.4,88.21 4.78,88.21 4.09,87.52 4.09,83.22 0.9,80.04 0.9,68.54 1.66,67.78 6.09,67.78 6.58,67.3 6.58,58.85 11.36,54.07 11.36,49.22 U2.4 | 7.69,99.01 R10.1
TX
  Top 0.15: U2.25 11.36,66.74 11.36,66.95 6.65,71.66 2.22,71.66 TP1.TP
USB_D+  (via drill 0.3)
  Top 0.15: v147.71,51.99 147.92,52.2 148.68,52.2 D1.4 | v42.94,48.81 v75.48,48.81 | v37.19,48.81 24.45,48.81 24.1,49.15 U2.14
  Bottom 0.15: v147.71,51.99 146.39,50.68 146.39,50.61 144.59,48.81 v75.48,48.81 | v37.19,48.81 v42.94,48.81
USB_D-  (via drill 0.3)
  Top 0.15: v147.99,54.83 148.68,54.14 D1.6 | v92.24,54.83 85.73,48.32 v42.45,48.32 | v37.53,48.32 24.72,48.32 24.58,48.18 23.55,48.18 22.85,48.88 22.85,49.15 U2.13
  Bottom 0.15: v92.24,54.83 v147.99,54.83 | v37.53,48.32 v42.45,48.32
VBAT
  Top 0.3: U4.2 131.09,51.71 131.09,51.3 U4.3 130.95,51.23 130.4,51.23 | 128.25,49.78 128.25,47.56 Q1.3 | 128.25,49.78 126.8,51.23 C2_BAT.1 126.66,51.16 125.48,49.98 123.27,49.98 MCP73831.3 | 130.4,51.23 129.77,51.23 128.39,49.85 128.25,49.78 | TP3.TP 138.36,60.37 138.15,60.37 130.4,52.61 130.4,51.37 130.4,51.23
VBUS  (via drill 0.3)
  Top 0.3: MCP73831.4 120.56,49.91 120.43,49.78 118.49,49.78 CHG_LED.A 118.42,49.64 118.42,49.36 117.86,48.81 117.86,45.2 118,45.07 118.07,44.93 | 113.08,48.88 113.08,43.4 113.92,42.57 R1_PWRUSB.2 113.99,42.44 115.51,42.44 D2.1 115.65,42.5 118.07,44.93 | 113.08,48.88 113.08,49.57 C1_BAT.1 | 118.07,44.93 122.36,44.93 122.85,45.41 127.28,45.41 Q1.1 | v145.22,52.82 145.49,53.1 146.19,53.1 D1.2 | 138.43,62.24 138.43,64.18 TP14.TP | 138.43,62.24 142.17,58.5 142.17,52.89 144.25,50.81 145.77,50.81 v145.91,50.75 146.05,50.75 146.53,50.26 C5_USB.1 146.67,50.19 146.67,49.08 146.74,49.01 C4_USB.1 146.67,48.88 145.08,47.28 145.08,46.45 PFMF.050.1.1 | 113.08,48.88 112.95,48.88 111.22,48.88 111.08,49.01 111.08,50.19 123.06,62.17 138.29,62.17 138.43,62.24
  Bottom 0.3: v145.22,52.82 145.22,51.44 v145.91,50.75
VRTC
  Top 0.15: C10_SUPERCAP.2 89.47,53.86 89.33,54 87.19,54 R_CAPACITOR.1 87.19,53.93 87.19,53.1 83.86,49.78 C8.1 84.07,49.5 82.89,50.68 82.82,50.68 81.92,51.58 U3.14
VUSB
  Top 0.3: J2.A9 163.98,56.84 163.98,56.56 J2.B4 164.12,56.49 164.68,56.49 165.16,56.01 165.16,52.61 164.61,52.06 164.12,52.06 J2.B9 163.98,51.99 163.98,51.78 J2.A4 163.84,51.71 156.44,51.71 151.17,46.45 149.58,46.45 PFMF.050.1.2